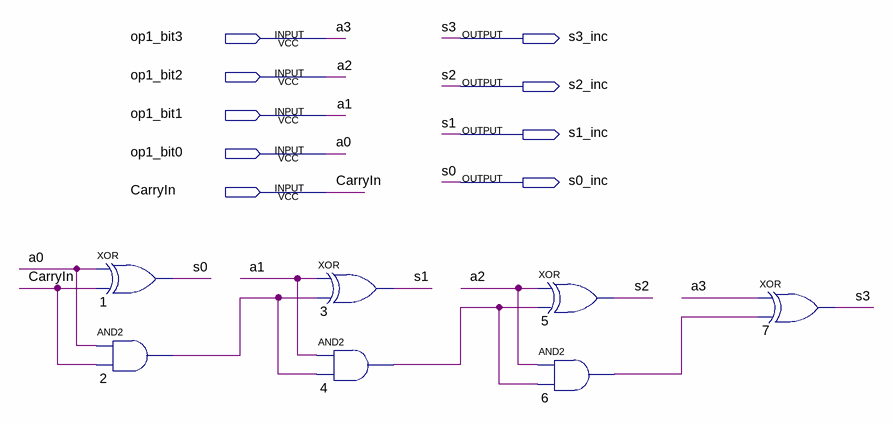
[diagram p0: schematic sheet]
// Quartus schematic inc_4bits.bdf as structural Verilog: 7 symbols, 9 pins
module inc_4bits (
  input  op1_bit3,
  input  op1_bit2,
  input  op1_bit1,
  input  op1_bit0,
  input  CarryIn,
  output s3_inc,
  output s2_inc,
  output s1_inc,
  output s0_inc
);

  wire n2_out, n4_out, n6_out;

  xor u_1 (s0_inc, op1_bit0, CarryIn);
  and u_2 (n2_out, op1_bit0, CarryIn);
  xor u_3 (s1_inc, op1_bit1, n2_out);
  and u_4 (n4_out, op1_bit1, n2_out);
  xor u_5 (s2_inc, op1_bit2, n4_out);
  and u_6 (n6_out, op1_bit2, n4_out);
  xor u_7 (s3_inc, op1_bit3, n6_out);

  // Other names for the same wires on the sheet: a0 = op1_bit0; a1 = op1_bit1; a2 = op1_bit2; a3 = op1_bit3;
  //   s0 = s0_inc; s1 = s1_inc; s2 = s2_inc; s3 = s3_inc
endmodule
